# Altium schematic sheet Schematic.SchDoc
size A3; SheetNumber: 1; SheetTotal: 1
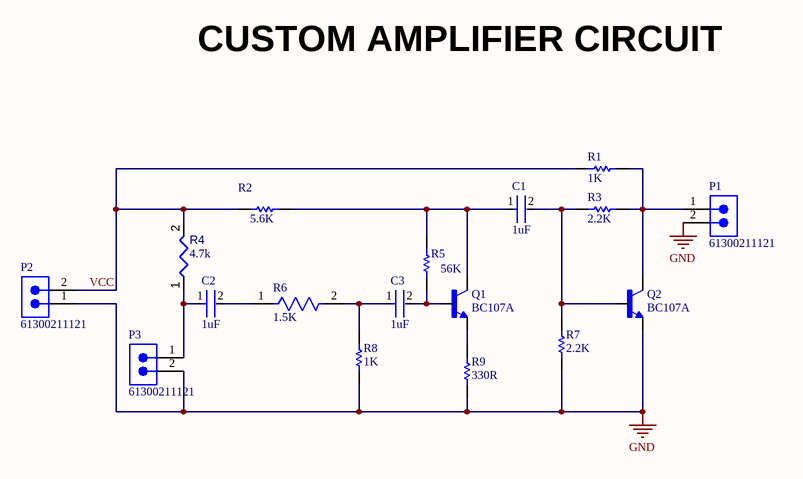
[diagram p0: Schematic.SchDoc]

## Parts
C1  1uF  [FP-1206-L_3_2_0_2-W_1_6_0-IPC_A]
C2  1uF  [FP-1206-L_3_2_0_2-W_1_6_0-IPC_A]
C3  1uF  [FP-1206-L_3_2_0_2-W_1_6_0-IPC_A]
P1  61300211121  [61300211121]
P2  61300211121  [61300211121]
P3  61300211121  [61300211121]
Q1  BC107A  [TO18]
Q2  BC107A  [TO18]
R1  1K  [RESC3116X65X40ML10T20]
R2  5.6K  [RESC3216X60X45LL10T20]
R3  2.2K  [RESC3116X65X40ML10T20]
R4  value 4.7k  [RESC3116X70X50ML13T20]  (hidden comment: Resistor 4k7 +/-1% 1206 250 mW)
R5  56K  [RESC3216X60X45NL10T20]
R6  1.5K  [FP-CRCW1206-e3-IPC_C]
R7  2.2K  [RESC3116X65X40ML10T20]
R8  1K  [RESC3116X65X40ML10T20]
R9  330R  [RESC3216X70X50NL05T20]

## Nets
GND: P1.2 P2.1 P3.2 Q2.1(E) R7.1 R8.1 R9.1
VCC: P2.2 R1.2 R2.1 R4.2
NetC1_1: C1.1 Q1.3(C) R2.2 R5.2
NetC1_2: C1.2 Q2.2(B) R3.1 R7.2
NetC2_1: C2.1 P3.1 R4.1
NetC2_2: C2.2 R6.1
NetC3_1: C3.1 R6.2 R8.2
NetC3_2: C3.2 Q1.2(B) R5.1
NetP1_1: P1.1 Q2.3(C) R1.1 R3.2
NetQ1_1: Q1.1(E) R9.2

## Notes on the sheet
- CUSTOM AMPLIFIER CIRCUIT

## Library data of the parts
C1-C3 = CMP-04427-000096-1: General Purpose Ceramic Capacitor, 1206, 1uF, 10%, X7R, 15%, 25V; Dissipation Factor: 3%; Insulation Resistance: 100GR; Case Code (Metric): 3216; Length: 3.2mm; Size: 1.78mm; Radiation Hardening: No; Construction: Flat; Capacitance: 1uF; Packaging: Tape and Reel; Voltage Rating (DC): 25V; Case Code (Imperial): 1206; Package Quantity: 1; Tolerance: 10%; Voltage Rating: 25V; Lead Free: Lead Free; Height: 1.78mm; Thickness: 0.07inch; Width: 1.6mm; Dielectric: X7R; Voltage: 25V; Contact Plating: Tin; Min Operating Temperature: -55°C; Number of Pins: 2; Series: -; Depth: 1.6mm; REACH SVHC: No SVHC; Case/Package: 1206; RoHS Compliant: Yes; Max Operating Temperature: 125°C; Termination: SMD/SMT; Mount: Surface Mount
P1-P3 = CMP-1712-00002-6: NexarPartId: 20081794; Number of Contacts: 2; Pitch: 2.54mm; Connector Type: Male Pin; Voltage Rating: 250V; Current Rating: 3A; Gender: Male; Contact Resistance: 20mΩ; Height: 8.94mm; Lead Free: Lead Free; Number of Pins: 2; Termination: Through Hole; RoHS: Compliant; Lead Pitch: 2.54mm; REACH SVHC: No SVHC; Housing Material: PBT; Contact Mating Length: 5.9944mm; Min Operating Temperature: -40°C; Orientation: Vertical; Contact Material: Copper; Contact Gender: Male; Max Operating Temperature: 125°C; Number of Rows: 1; Number of Positions: 2; Packaging: Bulk; Contact Plating: Gold; Mount: Through Hole; Color: Black; Operating Supply Voltage: 250V
Q1 Q2 = BC107A: Bipolar (BJT) Transistor; MF: Multicomp; SnapEDA_Link: https://www.snapeda.com/parts/BC107A/Multicomp/view-part/?ref=snap; Package: TO-18 Multicomp; Value: *; MP: BC107A; Check_prices: https://www.snapeda.com/parts/BC107A/Multicomp/view-part/?ref=eda
R1 R8 = CMP-2100-03678-1: Chip Resistor, 1 KOhm, +/- 1%, 0.25 W, -55 to 155 degC, 1206 (3216 Metric), RoHS, Tape and Reel; Manufacturer: Yageo; Temperature Coefficient: 100ppm/degreesC; Power Rating: 250mW; Voltage Rating: 200V; Resistance: 1KOhm; Composition: ThickFilm; Min Operating Temperature: -55degC; Tolerance: 1%; REACH SVHC: Unknown; Case Code (Metric): 3216; Military Standard: Not; Datasheet Version: Rev. 5, 10/2016; Package Reference: 1206.0; Case/Package: 1206; Length: 3.1mm; Manufacturer URL: http://www.yageo.com/; Lead Free: LeadFree; RoHSCompliant: true; Termination: SMD/SMT; Packaging: TapeandReel; Package Description: 2-Pin Surface Mount Device, Body 3.1 x 1.6 mm; Depth: 1.6mm; Case Code (Imperial): 1206; Max Operating Temperature: 155degC; Datasheet URL: http://www.yageo.com/NewPortal/yageodocoutput?fileName=/pdf/R-Chip/PYu-RC_Group_51_RoHS_L_5.pdf; Height: 0.55mm
R2 = CMP-2003-02302-1: Manufacturer: Vishay Dale; Part Number: CRCW12065K60FKEA
R3 R7 = CMP-1014-00546-2: Chip Resistor, 2.2 KOhm, +/- 1%, 250 mW, -55 to 155 degC, 1206 (3216 Metric), RoHS, Tape and Reel; Manufacturer: Yageo; Power Rating: 250mW; Voltage Rating: 200V; Temperature Coefficient: 100ppm/degreesC; RoHSCompliant: true; Packaging: TapeandReel; Termination: SMD/SMT; Case/Package: 1206; Case Code (Imperial): 1206; Manufacturer URL: http://www.yageo.com/; Max Power Dissipation: 250mW; Resistance: 2.2KOhm; Tolerance: 1%; Package Reference: 1206.0; Number of Terminations: 2; Depth: 1.6mm; Case Code (Metric): 3216; Lead Free: LeadFree; REACH SVHC: Unknown; Package Quantity: 1; Datasheet Version: Rev. 5, 10/2016; Length: 3.1mm; Weight: 0.000571oz; Composition: ThickFilm; Width: 0.063inch; Max Operating Temperature: 155degC; Package Description: 2-Pin Surface Mount Device, Body 3.1 x 1.6 mm; Min Operating Temperature: -55degC; Height: 0.55mm; Datasheet URL: http://www.yageo.com/NewPortal/yageodocoutput?fileName=/pdf/R-Chip/PYu-RC_Group_51_RoHS_L_5.pdf; Military Standard: Not
R4 = CMP-009-00033-5: Chip Resistor, 4.7 KOhm, +/- 1%, 0.25 W, -55 to 155 degC, 1206 (3216 Metric); Power: 250mW; Voltage Rating: 200V; Pins: 2; Min Operating Temperature: -55°C; Max Operating Temperature: 155°C; Case/Package: 1206; Tolerance: 1%; RoHS Compliant: True; Mounting Technology: SM
R5 = CMP-2003-02283-1: Part Number: CRCW120656K0JNEA; Manufacturer: Vishay Dale
R6 = CMP-02407-002229-1: RES Thick Film, 1.5kΩ, 1%, 0.25W, 100ppm/°C, 1206; Voltage Rating (DC): 200V; Power Rating: 250mW; Resistance: 1.5kR; Depth: 1.6mm; Case/Package: 1206; Packaging: Tape and Reel; Military Standard: Not; Radiation Hardening: No; Features: Automotive AEC-Q200; Number of Terminations: 2; Case Code (Imperial): 1206; Width: 0.063inch; Voltage Rating: 200V; Tolerance: 1%; Max Operating Temperature: 155°C; Weight: 0.000353oz; Package Quantity: 10; Temperature Coefficient: 100ppm/°C; Lead Free: Lead Free; Height: 0.024inch; Max Power Dissipation: 250mW; Termination: SMD/SMT; Length: 3.2mm; Contact Plating: Tin; Composition: Thick Film; Min Operating Temperature: -55°C; Case Code (Metric): 3216
R9 = CMP-2003-00307-1: Part Number: ERJ8ENF3300V; Manufacturer: Panasonic